# Altium schematic sheet ft232h.SchDoc
size A4
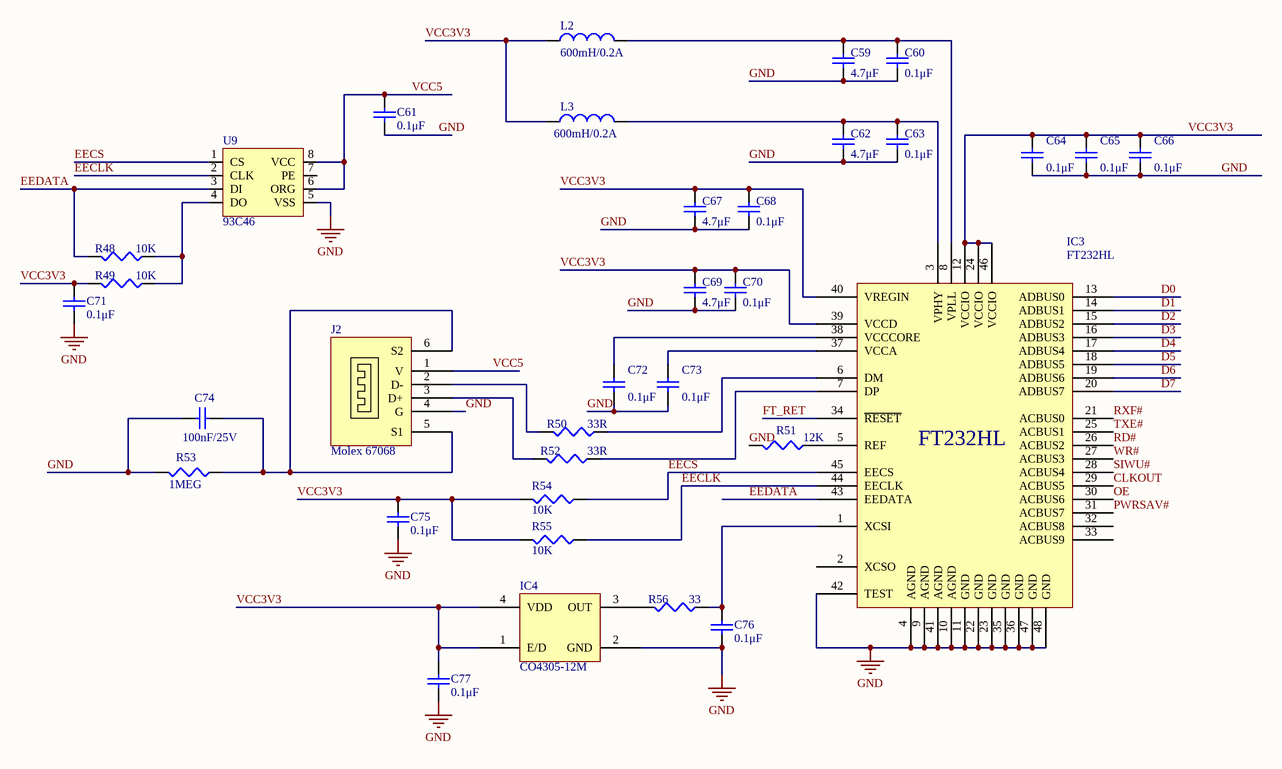
[diagram p0: ft232h.SchDoc]

## Parts
C59  value 4.7μF  [1608[0603]]  (hidden comment: Cap Semi)
C60  value 0.1μF  [1608[0603]]  (hidden comment: Cap Semi)
C61  value 0.1μF  [1608[0603]]  (hidden comment: Cap Semi)
C62  value 4.7μF  [1608[0603]]  (hidden comment: Cap Semi)
C63  value 0.1μF  [1608[0603]]  (hidden comment: Cap Semi)
C64  value 0.1μF  [1608[0603]]  (hidden comment: Cap Semi)
C65  value 0.1μF  [1608[0603]]  (hidden comment: Cap Semi)
C66  value 0.1μF  [1608[0603]]  (hidden comment: Cap Semi)
C67  value 4.7μF  [1608[0603]]  (hidden comment: Cap Semi)
C68  value 0.1μF  [1608[0603]]  (hidden comment: Cap Semi)
C69  value 4.7μF  [1608[0603]]  (hidden comment: Cap Semi)
C70  value 0.1μF  [1608[0603]]  (hidden comment: Cap Semi)
C71  value 0.1μF  [1608[0603]]  (hidden comment: Cap Semi)
C72  value 0.1μF  [1608[0603]]  (hidden comment: Cap Semi)
C73  value 0.1μF  [1608[0603]]  (hidden comment: Cap Semi)
C74  value 100nF/25V  [1608[0603]]  (hidden comment: Cap Semi)
C75  value 0.1μF  [1608[0603]]  (hidden comment: Cap Semi)
C76  value 0.1μF  [1608[0603]]  (hidden comment: Cap Semi)
C77  value 0.1μF  [1608[0603]]  (hidden comment: Cap Semi)
IC3  FT232HL  [LQFP-48_L]
IC4  CO4305-12M  [CO4305-12]
J2  Molex 67068  [USB-A]
L2  value 600mH/0.2A  [0603]  (hidden comment: Inductor)
L3  value 600mH/0.2A  [0603]  (hidden comment: Inductor)
R48  value 10K  [J1-0603]  (hidden comment: Res3)
R49  value 10K  [J1-0603]  (hidden comment: Res3)
R50  value 33R  [J1-0603]  (hidden comment: Res3)
R51  value 12K  [J1-0603]  (hidden comment: Res3)
R52  value 33R  [J1-0603]  (hidden comment: Res3)
R53  value 1MEG  [J1-0603]  (hidden comment: Res3)
R54  value 10K  [J1-0603]  (hidden comment: Res3)
R55  value 10K  [J1-0603]  (hidden comment: Res3)
R56  value 33  [J1-0603]  (hidden comment: Res3)
U9  93C46  [SOIC127P600X175-8N]

## Nets
GND: C59.1 C60.1 C61.1 C62.1 C63.1 C64.1 C65.1 C66.1 C67.1 C68.1 C69.1 C70.1 C71.1 C72.1 C73.1 C74.1 C75.1 C76.1 C77.1 IC3.4(AGND) IC3.9(AGND) IC3.10(AGND) IC3.11(GND) IC3.22(GND) IC3.23(GND) IC3.35(GND) IC3.36(GND) IC3.41(AGND) IC3.42(TEST) IC3.47(GND) IC3.48(GND) IC4.2(GND) J2.4(G) R51.2 R53.2 U9.5(VSS)
CLKOUT: IC3.29(ACBUS5)
D0: IC3.13(ADBUS0)
D1: IC3.14(ADBUS1)
D2: IC3.15(ADBUS2)
D3: IC3.16(ADBUS3)
D4: IC3.17(ADBUS4)
D5: IC3.18(ADBUS5)
D6: IC3.19(ADBUS6)
D7: IC3.20(ADBUS7)
EECLK: IC3.44(EECLK) R55.1 U9.2(CLK)
EECS: IC3.45(EECS) R54.1 U9.1(CS)
EEDATA: IC3.43(EEDATA) R48.2 U9.3(DI)
FT_RET: IC3.34(~{RESET})
OE: IC3.30(ACBUS6)
PWRSAV#: IC3.31(ACBUS7)
RD#: IC3.26(ACBUS2)
RXF#: IC3.21(ACBUS0)
SIWU#: IC3.28(ACBUS4)
TXE#: IC3.25(ACBUS1)
VCC3V3: C64.2 C65.2 C66.2 C67.2 C68.2 C69.2 C70.2 C71.2 C75.2 C77.2 IC3.12(VCCIO) IC3.24(VCCIO) IC3.39(VCCD) IC3.40(VREGIN) IC3.46(VCCIO) IC4.1(E/D) IC4.4(VDD) L2.1 L3.1 R49.2 R54.2 R55.2
VCC5: C61.2 J2.1(V) U9.6(ORG) U9.8(VCC)
WR#: IC3.27(ACBUS3)
NetC59_2: C59.2 C60.2 IC3.8(VPLL) L2.2
NetC62_2: C62.2 C63.2 IC3.3(VPHY) L3.2
NetC72_2: C72.2 IC3.38(VCCCORE)
NetC73_2: C73.2 IC3.37(VCCA)
NetC74_2: C74.2 J2.5(S1) J2.6(S2) R53.1
NetC76_2: C76.2 IC3.1(XCSI) R56.1
NetIC3_5: IC3.5(REF) R51.1
NetIC3_6: IC3.6(DM) R50.1
NetIC3_7: IC3.7(DP) R52.1
NetIC4_3: IC4.3(OUT) R56.2
NetJ2_2: J2.2(D-) R50.2
NetJ2_3: J2.3(D+) R52.2
NetR48_1: R48.1 R49.1 U9.4(DO)

Not connected (* = marked no-connect by the designer): IC3 2(XCSO) 32(ACBUS8) 33(ACBUS9); U9 7(PE)

## Library data of the parts
C59-C77 = Cap Semi: Capacitor (Semiconductor SIM Model); Published: 8-Jun-2000; LatestRevisionDate: 29-May-2009; LatestRevisionNote: IPC-7351 Footprint Added.; PackageReference: C1206; Publisher: Altium Limited; PackageDescription: Chip Capacitor
L2 L3 = Inductor: Code_IEC: 1005; Published: 8-Jun-2000; LatestRevisionDate: 29-May-2009; LatestRevisionNote: IPC-7351 Footprint Added.; PackageReference: 0402-A; Publisher: Altium Limited; PackageDescription: Chip Inductor; Code_JEITA: 0402
R48-R56 = Res3: Resistor; Published: 8-Jun-2000; LatestRevisionDate: 29-May-2009; LatestRevisionNote: IPC-7351 Footprint Added.; PackageReference: J1-0603; Publisher: Altium Limited; PackageDescription: Chip Resistor